# EAGLE design LPF (EAGLE 6.1)
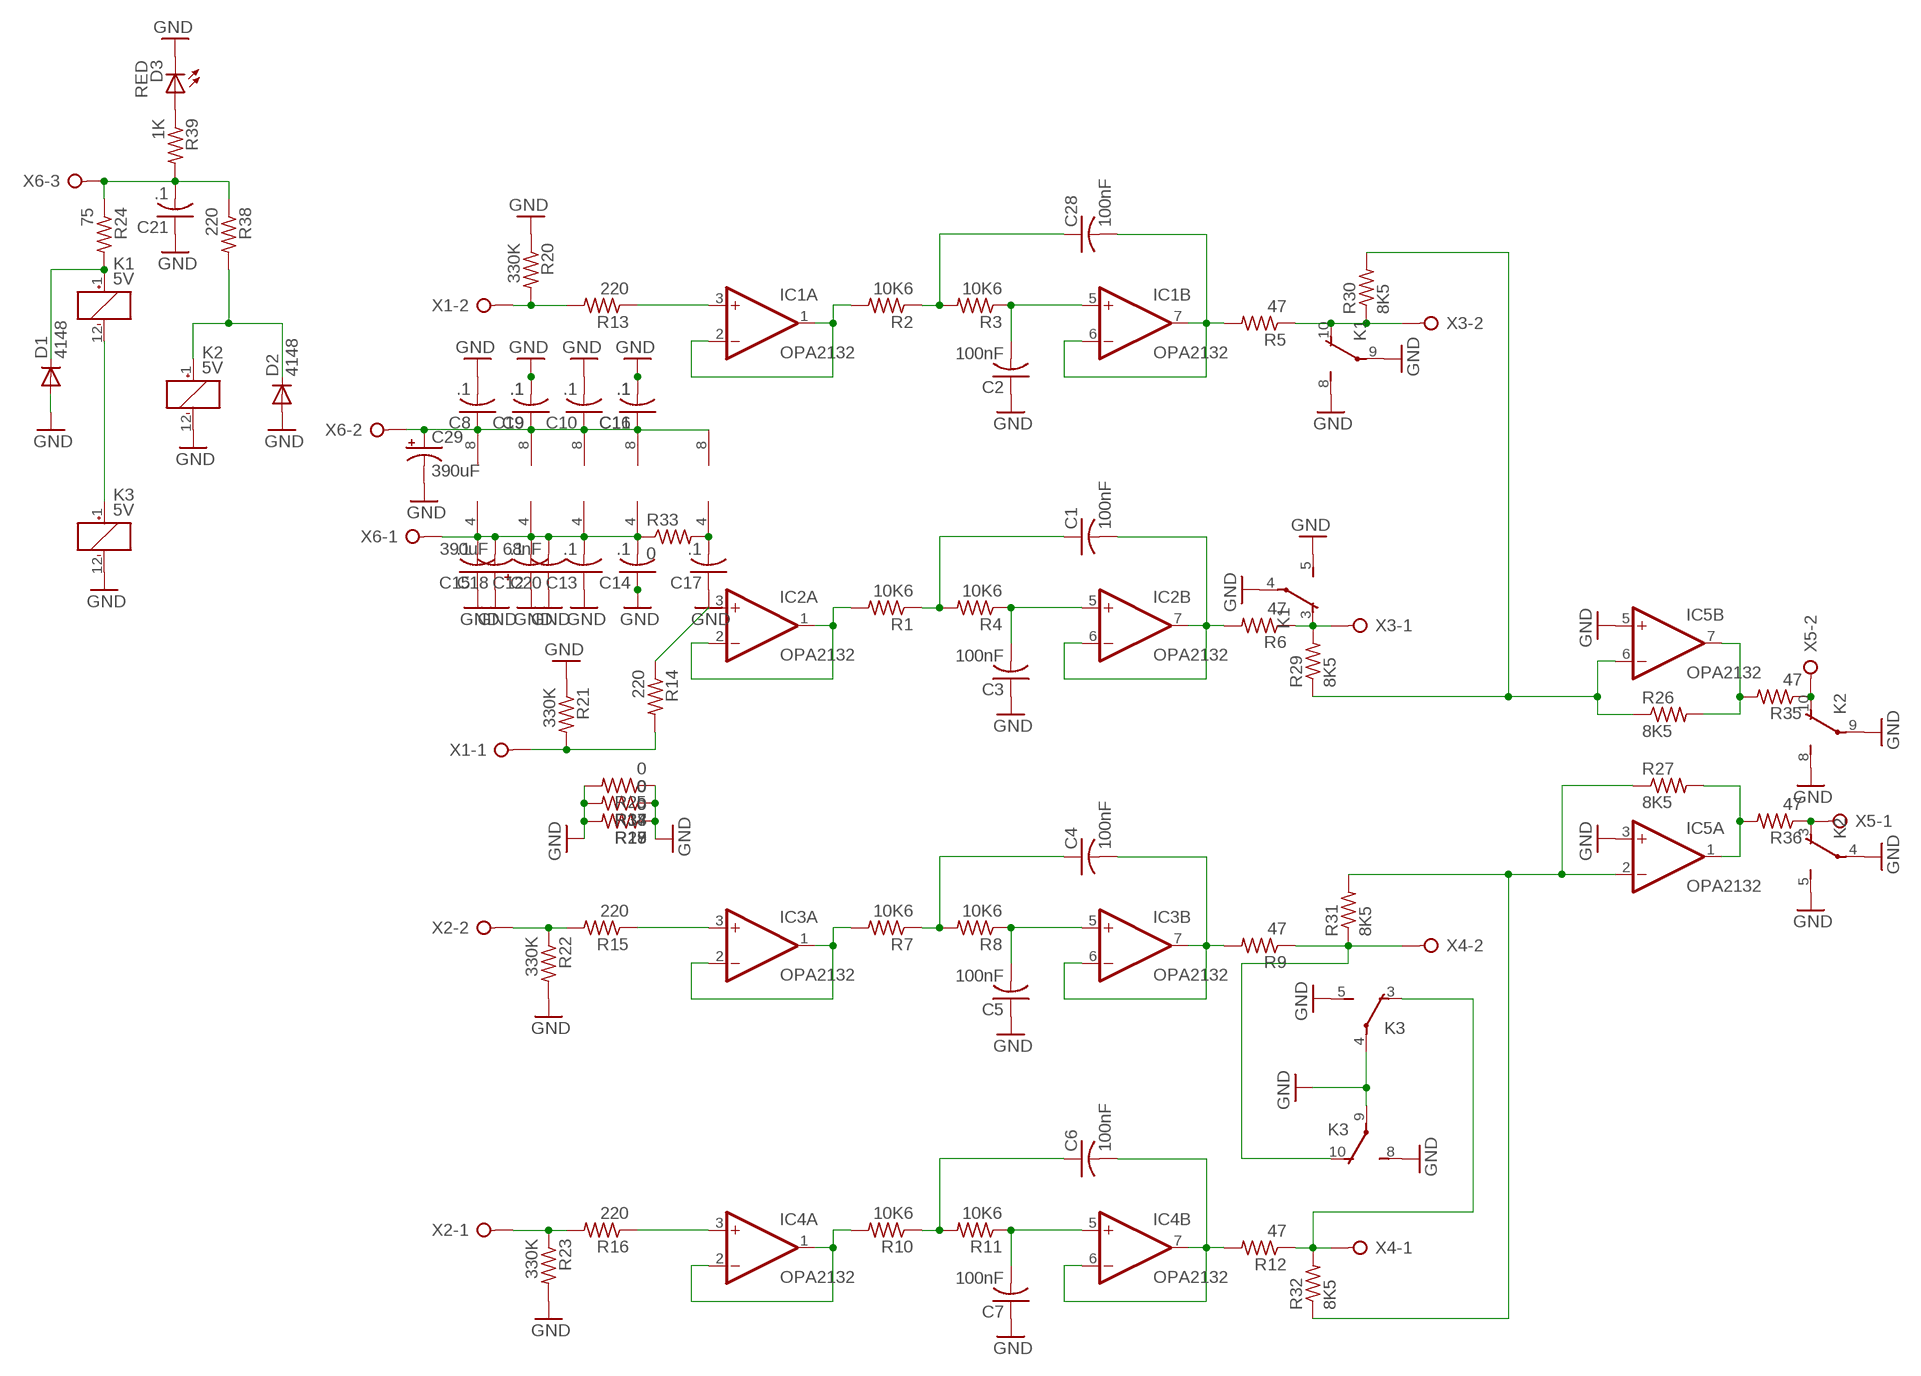
[diagram p0: schematic, sheet 1]

## Parts
C1  100nF  C-US050-075X075  [C050-075X075]
C2  100nF  C-US050-075X075  [C050-075X075]
C3  100nF  C-US050-075X075  [C050-075X075]
C4  100nF  C-US050-075X075  [C050-075X075]
C5  100nF  C-US050-075X075  [C050-075X075]
C6  100nF  C-US050-075X075  [C050-075X075]
C7  100nF  C-US050-075X075  [C050-075X075]
C8  .1  C-USC4532  [C4532]
C9  .1  C-USC4532  [C4532]
C10  .1  C-USC4532  [C4532]
C11  .1  C-USC4532  [C4532]
C12  .1  C-USC4532  [C4532]
C13  .1  C-USC4532  [C4532]
C14  .1  C-USC4532  [C4532]
C15  .1  C-USC4532  [C4532]
C16  .1  C-USC4532  [C4532]
C17  .1  C-USC4532  [C4532]
C18  390uF  CPOL-USE5-13  [E5-13]
C19  .1  C-USC4532  [C4532]
C20  68nF  C-US075-042X103  [C075-042X103]
C21  .1  C-USC4532  [C4532]
C28  100nF  C-US050-075X075  [C050-075X075]
C29  390uF  CPOL-USE5-13  [E5-13]
D1  4148  1N4148DO35-7  [DO35-7]
D2  4148  1N4148DO35-7  [DO35-7]
D3  RED  SFH482  [SFH482]
IC1  OPA2132  LM1458N  [DIL08]
IC2  OPA2132  LM1458N  [DIL08]
IC3  OPA2132  LM1458N  [DIL08]
IC4  OPA2132  LM1458N  [DIL08]
IC5  OPA2132  LM1458N  [DIL08]
K1  5V  TX2-12V  [TX2]
K2  5V  TX2-12V  [TX2]
K3  5V  TX2-12V  [TX2]
R1  10K6  R-US_0207/10  [0207/10]
R2  10K6  R-US_0207/10  [0207/10]
R3  10K6  R-US_0207/10  [0207/10]
R4  10K6  R-US_0207/10  [0207/10]
R5  47  R-US_0207/12  [0207/12]
R6  47  R-US_0207/12  [0207/12]
R7  10K6  R-US_0207/10  [0207/10]
R8  10K6  R-US_0207/10  [0207/10]
R9  47  R-US_0207/12  [0207/12]
R10  10K6  R-US_0207/10  [0207/10]
R11  10K6  R-US_0207/10  [0207/10]
R12  47  R-US_0207/10  [0207/10]
R13  220  R-US_0207/10  [0207/10]
R14  220  R-US_0207/10  [0207/10]
R15  220  R-US_0207/10  [0207/10]
R16  220  R-US_0207/10  [0207/10]
R17  0  R-US_0204/7  [0204/7]
R18  0  R-US_0204/7  [0204/7]
R19  0  R-US_0204/7  [0204/7]
R20  330K  R-US_R1210  [R1210]
R21  330K  R-US_R1210  [R1210]
R22  330K  R-US_R1210  [R1210]
R23  330K  R-US_R1210  [R1210]
R24  75  R-US_0207/10  [0207/10]
R25  0  R-US_0204/7  [0204/7]
R26  8K5  R-US_R1210  [R1210]
R27  8K5  R-US_R1210  [R1210]
R28  0  R-US_0204/7  [0204/7]
R29  8K5  R-US_R1210  [R1210]
R30  8K5  R-US_R1210  [R1210]
R31  8K5  R-US_R1210  [R1210]
R32  8K5  R-US_R1210  [R1210]
R33  0  R-US_0207/12  [0207/12]
R34  0  R-US_0204/7  [0204/7]
R35  47  R-US_0207/10  [0207/10]
R36  47  R-US_0207/10  [0207/10]
R37  0  R-US_0207/10  [0207/10]
R38  220  R-US_0309/12  [0309/12]
R39  1K  R-US_0207/10  [0207/10]
X1  W237-02P  [W237-132]
X2  W237-02P  [W237-132]
X3  W237-02P  [W237-132]
X4  W237-02P  [W237-132]
X5  W237-02P  [W237-132]
X6  W237-3E  [W237-3E]

## Nets
GND: C2.1 C3.1 C5.1 C7.1 C8.2 C9.2 C10.2 C11.2 C12.1 C13.1 C14.1 C15.1 C16.2 C17.1 C18.+ C19.2 C20.1 C21.1 C29.- D1.A D2.A D3.K(C) IC5.3(A:+IN) IC5.5(B:+IN) K1.4(1:P) K1.5(1:S) K1.8(2:S) K1.9(2:P) K2.4(1:P) K2.5(1:S) K2.8(2:S) K2.9(2:P) K2.12(_:-) K3.4(1:P) K3.5(1:S) K3.8(2:S) K3.9(2:P) K3.12(_:-) R17.1 R17.2 R18.1 R18.2 R19.1 R19.2 R20.1 R21.1 R22.2 R23.2 R25.1 R25.2 R28.1 R28.2 R34.1 R34.2 R37.1 R37.2
N$1: IC1.1(A:OUT) IC1.2(A:-IN) R2.2
N$2: C28.2 IC1.6(B:-IN) IC1.7(B:OUT) R5.2
N$3: C2.2 IC1.5(B:+IN) R3.1
N$4: C28.1 R2.1 R3.2
N$5: IC1.3(A:+IN) R13.1
N$6: R14.2 R21.2 X1.1
N$7: R13.2 R20.2 X1.2
N$8: IC2.1(A:OUT) IC2.2(A:-IN) R1.2
N$9: IC2.3(A:+IN) R14.1
N$10: C1.2 IC2.6(B:-IN) IC2.7(B:OUT) R6.2
N$11: C3.2 IC2.5(B:+IN) R4.1
N$12: C1.1 R1.1 R4.2
N$13: C12.2 C13.2 C14.2 C15.2 C18.- C20.2 IC1.4(P:V-) IC2.4(P:V-) IC3.4(P:V-) IC4.4(P:V-) R33.1 X6.1
N$14: C8.1 C9.1 C10.1 C11.1 C16.1 C19.1 C29.+ IC1.8(P:V+) IC2.8(P:V+) IC3.8(P:V+) IC4.8(P:V+) IC5.8(P:V+) X6.2
N$15: IC3.1(A:OUT) IC3.2(A:-IN) R7.2
N$16: IC3.3(A:+IN) R15.1
N$17: C4.2 IC3.6(B:-IN) IC3.7(B:OUT) R9.2
N$18: C5.2 IC3.5(B:+IN) R8.1
N$19: C4.1 R7.1 R8.2
N$20: R15.2 R22.1 X2.2
N$21: R16.2 R23.1 X2.1
N$22: IC4.1(A:OUT) IC4.2(A:-IN) R10.2
N$23: IC4.3(A:+IN) R16.1
N$24: C6.2 IC4.6(B:-IN) IC4.7(B:OUT) R12.2
N$25: C7.2 IC4.5(B:+IN) R11.1
N$26: C6.1 R10.1 R11.2
N$27: K3.3(1:O) R12.1 R32.2 X4.1
N$28: K3.10(2:O) R9.1 R31.1 X4.2
N$29: K1.12(_:-) K3.1(_:+)
N$30: K1.10(2:O) R5.1 R30.1 X3.2
N$31: K1.3(1:O) R6.1 R29.2 X3.1
N$32: C17.2 IC5.4(P:V-) R33.2
N$33: D1.C K1.1(_:+) R24.2
N$34: IC5.6(B:-IN) R26.1 R29.1 R30.2
N$35: IC5.7(B:OUT) R26.2 R35.2
N$36: IC5.1(A:OUT) R27.2 R36.2
N$37: K2.10(2:O) R35.1 X5.2
N$38: IC5.2(A:-IN) R27.1 R31.2 R32.1
N$39: K2.3(1:O) R36.1 X5.1
N$40: D2.C K2.1(_:+) R38.2
N$41: C21.2 R24.1 R38.1 R39.2 X6.3
N$42: D3.A R39.1

## Library data of the parts
C1-C17 C19-C21 C28 = resistor:C-US: CAPACITOR, American symbol
C18 C29 = resistor:CPOL-US: POLARIZED CAPACITOR, American symbol
D1 D2 = diode:1N4148: DIODE high speed (Philips)
D3 = led:SFH482: IR LED infrared emitting diode, Infineon
IC1-IC5 = linear:*1458: OP AMP
K1-K3 = relay:TX2?-*: 2 AMP. HIGH CAPACITY RELAY NAiS WITH HIGH SURGE VOLTAGE & HIGH BREAKDOWN VOLTAGE Source: http://www.mew-europe.com/.. en_ds_61022_0001.pdf; MF: AROMAT/ MATSUSHITA; MPN: TX2-12V; OC_FARNELL: 1200952; OC_NEWARK: 67K1295
R1-R39 = resistor:R-US_: RESISTOR, American symbol
X1-X5 = con-wago-508:W237-02P: WAGO SREW CLAMP; OC_FARNELL: unknown; OC_NEWARK: unknown
X6 = con-wago-508:W237-3E: WAGO SREW CLAMP; OC_FARNELL: unknown; OC_NEWARK: unknown

## Board
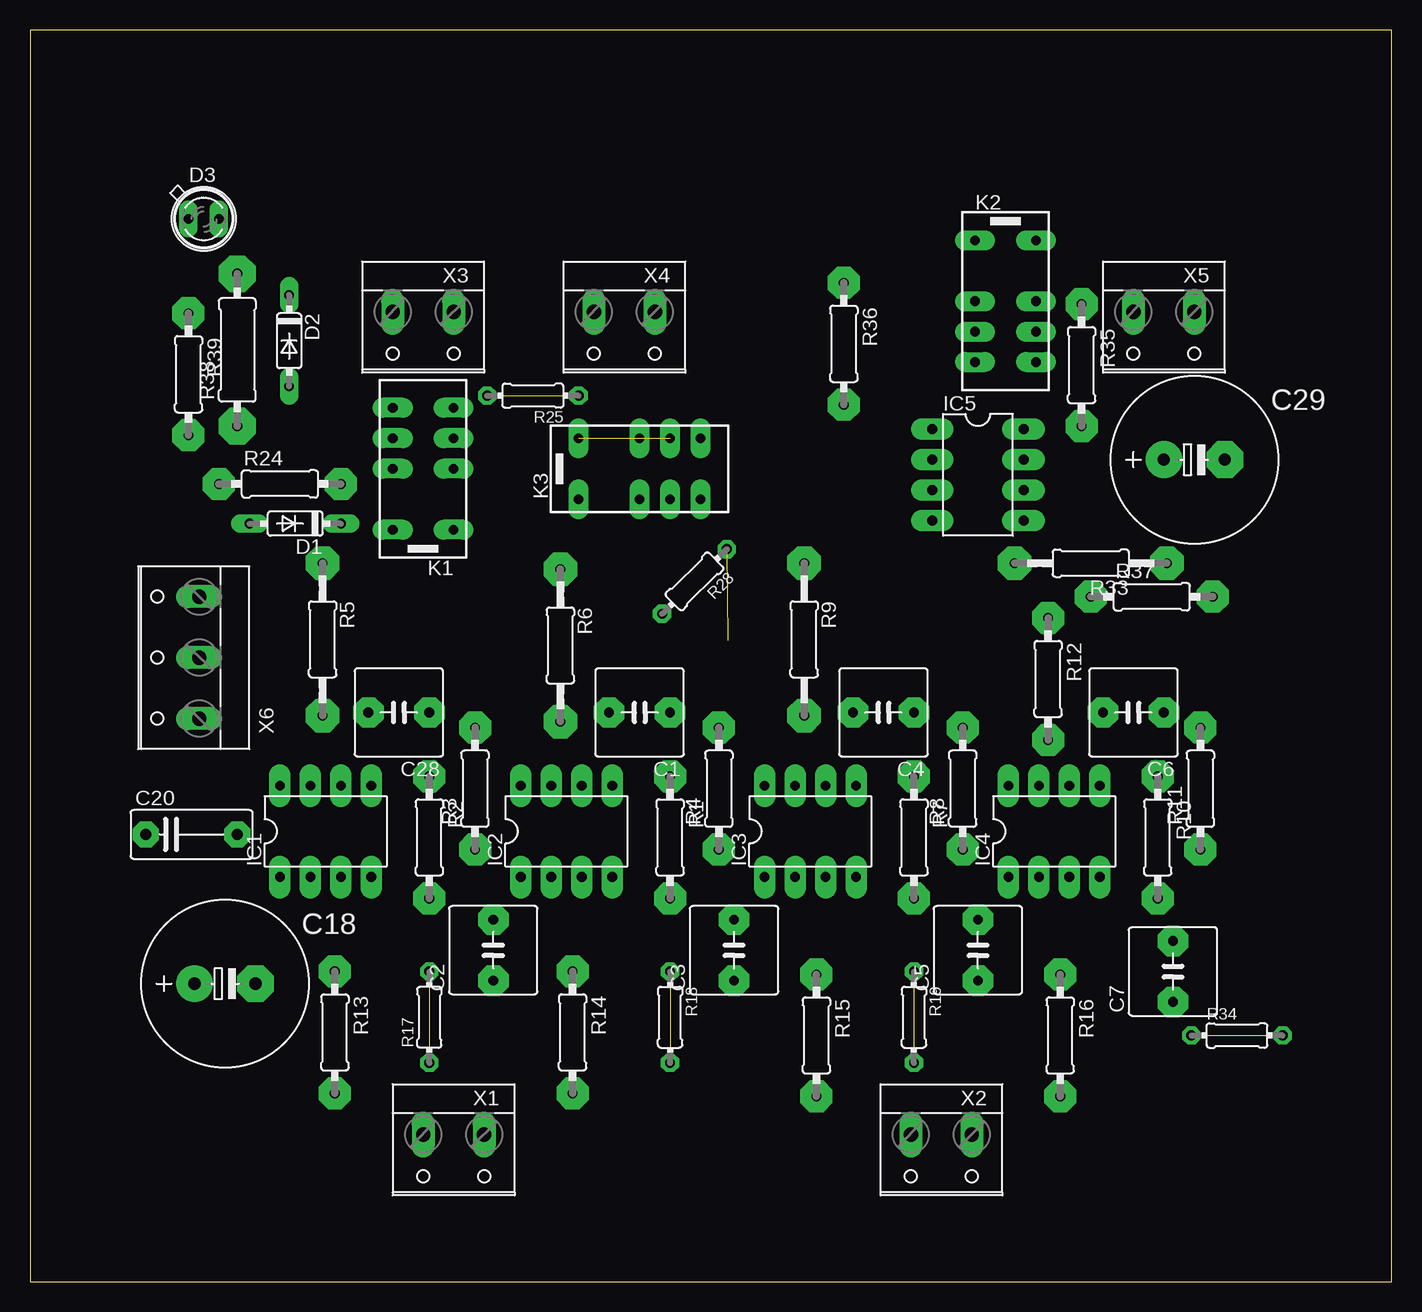
[diagram p1: board, top side]
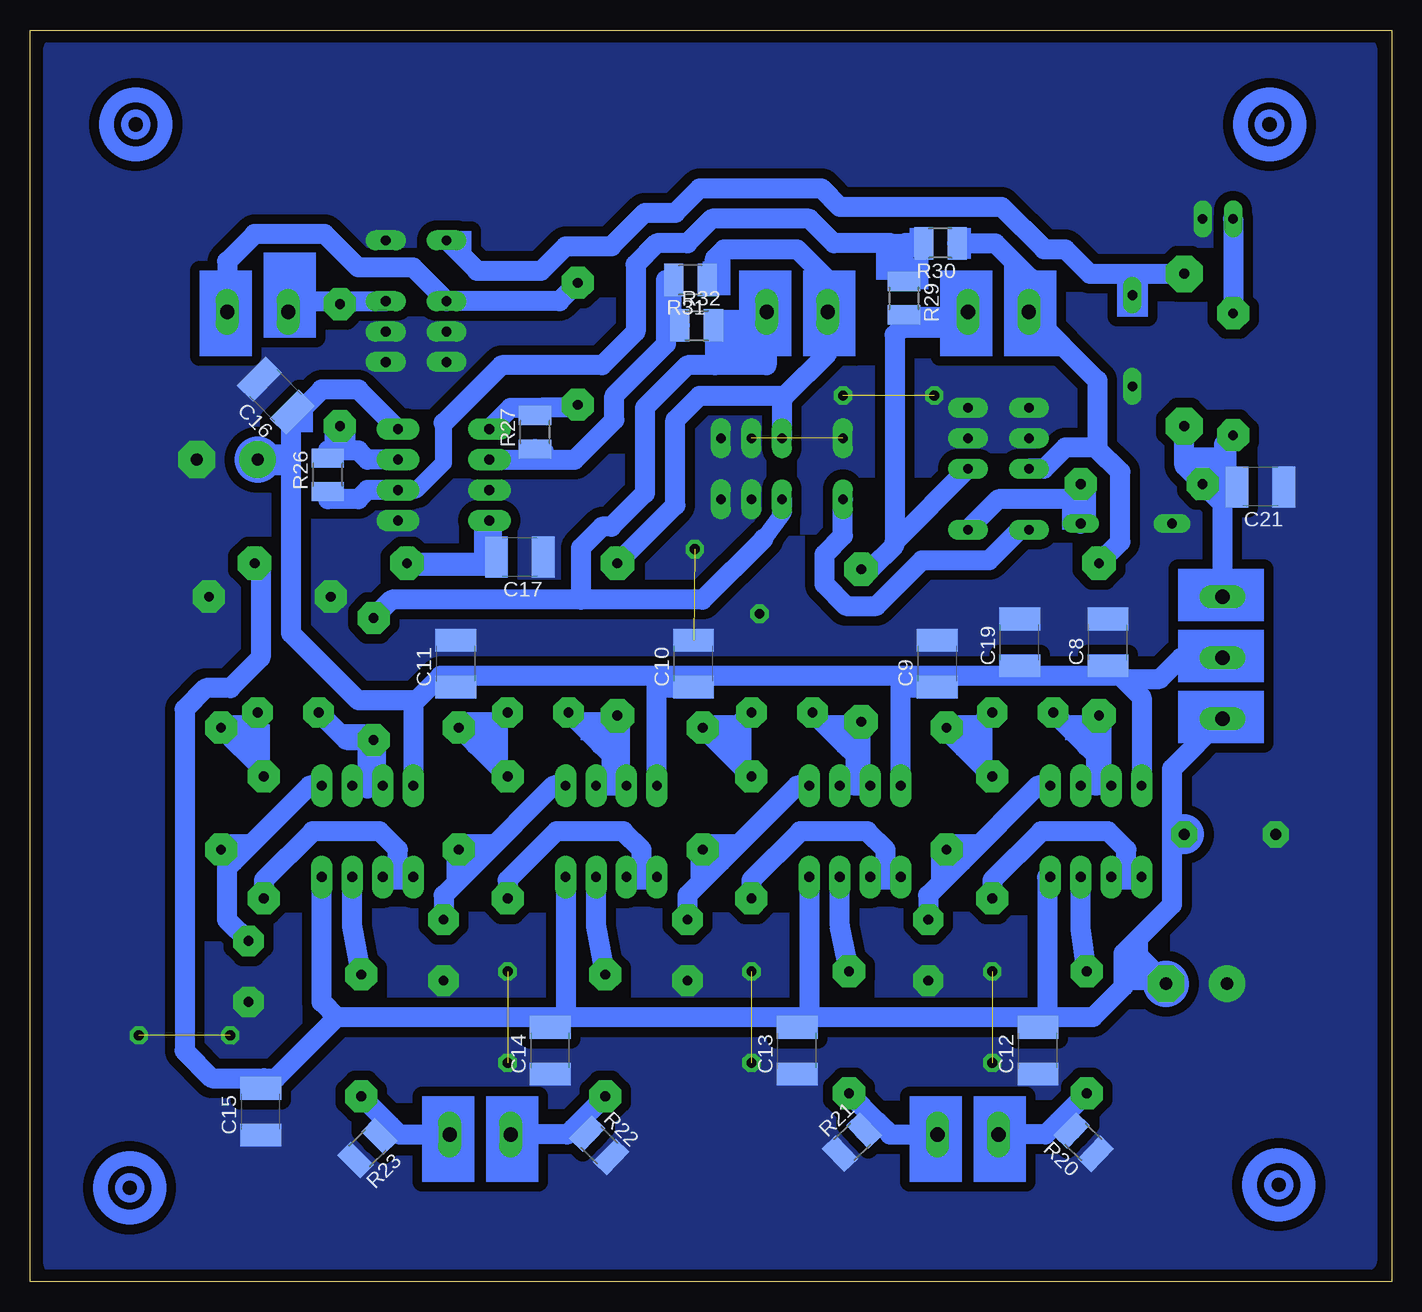
[diagram p2: board, bottom side, seen from below]

Size 113.46 x 104.37 mm. Coordinates in mm from the lower left corner, seen from the top.
Outline: 0,104.37 0,0 113.46,0 113.46,104.37 0,104.37
Copper layers (1*16): Top 0.035mm / dielectric 1.5mm / Bottom 0.035mm
Design rules: minimum track width 10mil, minimum drill 24mil, track to track 8mil, track to pad 8mil, pad to pad 8mil, via to via 8mil, smd to smd 8mil, copper to edge 40mil, drill to drill 8mil, minimum pad ring 14mil, minimum via ring 8mil, stop-mask expansion 4mil, vias tented up to drill 0mil, thermal gap 10mil

### Footprints (pad centres in the part's own frame; a part is rotated, then mirrored left to right if it is on the bottom)
C050-075X075 = drill 0.813 pad 2.54 octagon: 1 -2.54,0; 2 2.54,0
C4532 = smd 1.9 x 3.4: 1 -1.95,0; 2 1.95,0
E5-13 = drill 1.016 pad 3.048: + -2.54,0 | drill 1.016 pad 3.048 octagon: - 2.54,0
C075-042X103 = drill 0.914 pad 2.184 octagon: 1 -3.81,0; 2 3.81,0
DO35-7 = drill 0.813 long: A 3.81,0; C -3.81,0
SFH482 = drill 0.813 long: A -1.27,0; K 1.27,0
DIL08 = drill 0.813 pad 1.778 long: 1 -3.81,-3.81; 2 -1.27,-3.81; 3 1.27,-3.81; 4 3.81,-3.81; 5 3.81,3.81; 6 1.27,3.81; 7 -1.27,3.81; 8 -3.81,3.81
TX2 = drill 0.8 pad 1.676 long: 1 -5.08,-2.54; 3 0,-2.54; 4 2.54,-2.54; 5 5.08,-2.54; 8 5.08,2.54; 9 2.54,2.54; 10 0,2.54; 12 -5.08,2.54
0207/10 = drill 0.813 pad 2.667 octagon: 1 -5.08,0; 2 5.08,0
0207/12 = drill 0.813 pad 2.794 octagon: 1 -6.35,0; 2 6.35,0
0204/7 = drill 0.813 octagon: 1 -3.81,0; 2 3.81,0
R1210 = smd 1.6 x 2.7: 1 -1.4,0; 2 1.4,0
0309/12 = drill 0.813 pad 3.048 octagon: 1 -6.35,0; 2 6.35,0
W237-132 = drill 1.194 long: 1 -2.54,-0.635; 2 2.54,-0.635
W237-3E = drill 1.194 long: 1 -5.08,-0.635; 2 0,-0.635; 3 5.08,-0.635

### Placement (x,y rotation side)
C1  50.8,47.48 180 top
C2  38.61,27.67 90 top
C3  58.67,27.67 90 top
C4  71.12,47.48 180 top
C5  78.99,27.67 90 top
C6  91.95,47.48 180 top
C7  95.25,25.89 90 top
C8  23.62,53.32 90 bottom
C9  37.85,51.54 90 bottom
C10  58.17,51.54 90 bottom
C11  77.98,51.54 90 bottom
C12  29.46,19.28 90 bottom
C13  49.53,19.28 90 bottom
C14  70.1,19.28 90 bottom
C15  94.23,14.2 90 bottom
C16  92.96,73.89 134.9 bottom
C17  72.64,60.43 180 bottom
C18  16.26,24.87 0 top
C19  30.99,53.32 90 bottom
C20  13.46,37.32 0 top
C21  10.92,66.27 180 bottom
C28  30.73,47.48 180 top
C29  97.03,68.56 0 top
D1  22.1,63.23 180 top
D2  21.59,78.47 270 top
D3  14.48,88.63 0 top
IC1  24.64,37.57 0 top
IC2  44.7,37.57 0 top
IC3  65.02,37.57 0 top
IC4  85.34,37.57 0 top
IC5  78.99,67.29 270 top
K1  32.77,67.8 90 top
K2  81.28,81.77 270 top
K3  50.8,67.8 0 top
R1  53.34,37.06 270 top
R2  33.27,37.06 270 top
R3  37.08,41.13 90 top
R4  57.4,41.13 90 top
R5  24.38,53.57 270 top
R6  44.2,53.07 270 top
R7  73.66,37.06 270 top
R8  77.72,41.13 90 top
R9  64.52,53.57 270 top
R10  93.98,37.06 270 top
R11  97.54,41.13 90 top
R12  84.84,50.27 270 top
R13  25.4,20.81 270 top
R14  45.21,20.81 270 top
R15  65.53,20.55 270 top
R16  85.85,20.55 270 top
R17  33.27,22.08 90 top
R18  53.34,22.08 270 top
R19  73.66,22.08 270 top
R20  25.65,11.66 135.8 bottom
R21  44.96,11.66 43.9 bottom
R22  66.04,11.41 315.6 bottom
R23  85.34,11.16 225 bottom
R24  20.83,66.53 0 top
R25  41.91,73.89 180 top
R26  88.65,67.29 90 bottom
R27  71.37,70.85 90 bottom
R28  55.37,58.4 225 top
R29  40.64,82.02 270 bottom
R30  37.59,86.59 180 bottom
R31  58.42,83.55 180 bottom
R32  57.91,79.74 0 bottom
R33  88.39,59.92 180 top
R34  100.58,20.55 0 top
R35  87.63,76.43 270 top
R36  67.82,78.21 270 top
R37  93.47,57.13 0 top
R38  17.27,77.7 90 top
R39  13.21,75.67 270 top
X1  35.31,11.66 180 top
X2  75.95,11.66 180 top
X3  32.77,80.24 180 top
X4  49.53,80.24 180 top
X5  94.49,80.24 180 top
X6  13.46,52.05 90 top

### Tracks (layer width: path | path; a pad name or v marks a point on that pad's centre or on a via)
GND  (7 unrouted)
  pour Bottom (isolate 0.813, no thermals): 111.51,102.85 2.03,102.85 2.03,1.76 111.51,1.5
N$1
  Bottom 1.676: IC1.1 22.1,33.76 | IC1.2 22.1,33.76 | 22.1,33.76 22.1,36.05 23.62,37.57 29.21,37.57 33.27,33.51 R2.2
N$2
  Bottom 1.676: IC1.7 24.64,41.38 | 24.64,41.38 IC1.6 | C28.2 25.4,44.68 | 25.4,44.68 24.64,43.92 24.64,41.38 | R5.2 25.4,44.94 25.4,44.68
N$3
  Bottom 1.676: IC1.5 29.46,41.38 35.81,35.03 | 35.81,35.03 38.61,32.24 C2.2 | R3.1 35.81,35.03
N$4
  Bottom 1.676: R2.1 35.69,44.56 | 35.69,44.56 37.08,45.95 R3.2 | C28.1 35.69,45.06 35.69,44.56
N$5
  Bottom 1.676: R13.1 25.91,29.44 IC1.3
N$6
  Bottom 1.676: R14.2 42.8,13.32 | 42.8,13.32 41.78,12.3 X1.1 | R21.2 43.27,13.32 42.8,13.32
N$7
  Bottom 1.676: R13.2 27.81,13.32 | 27.81,13.32 28.83,12.3 X1.2 | R20.2 27.33,13.32 27.81,13.32
N$8
  Bottom 1.676: IC2.1 42.16,33.76 | IC2.2 42.16,33.76 | 42.16,33.76 42.16,36.05 43.69,37.57 49.28,37.57 53.34,33.51 R1.2
N$9
  Bottom 1.676: R14.1 45.97,29.7 IC2.3
N$10
  Bottom 1.676: C1.2 45.59,44.81 | 45.59,44.81 44.7,43.92 44.7,41.38 | 44.7,41.38 IC2.6 | 44.7,41.38 IC2.7 | R6.2 45.59,44.81
N$11
  Bottom 1.676: IC2.5 49.53,41.38 55.88,35.03 | 55.88,35.03 58.67,32.24 C3.2 | R4.1 55.88,35.03
N$12
  Bottom 1.676: R1.1 56.26,45.06 | 56.26,45.06 R4.2 | C1.1 55.75,45.06 56.26,45.06
N$13
  Bottom 1.676: IC2.4 48.51,22.08 | IC1.4 28.7,33.76 28.7,22.08 | 28.7,22.08 28.96,22.08 | 28.96,22.08 48.51,22.08 | 48.51,22.08 49.53,22.08 | 49.53,22.08 68.83,22.08 | 68.83,22.08 69.6,22.08 | 69.6,22.08 87.88,22.08 | IC3.4 68.83,22.08 | C14.2 69.6,21.74 69.6,22.08 | C13.2 49.53,22.08 | C12.2 28.96,21.74 28.96,22.08 | 93.98,17 98.3,17 100.58,19.28 100.58,47.73 98.81,49.51 96.77,49.51 94.23,52.05 94.23,59.42 R33.1 | 93.98,17 92.96,17 87.88,22.08 | C15.2 93.98,16.41 93.98,17 | 87.88,22.08 89.15,23.35 IC4.4 | X6.1 18.29,42.78 18.29,37.06 | 28.7,22.08 24.89,22.08 22.35,24.62 22.35,27.41 | 18.29,37.06 18.29,31.48 22.35,27.41 | C18.- 21.34,27.41 22.35,27.41 | C20.2 17.53,37.06 18.29,37.06
N$14
  Bottom 1.676: IC2.8 40.89,50.53 | 40.89,50.53 61.21,50.53 | 61.21,50.53 79.25,50.53 | 22.61,50.53 31.24,50.53 | 31.24,50.53 40.89,50.53 | 81.53,48.49 IC4.8 | IC3.8 61.21,50.53 | C9.1 40.89,50.53 | 61.21,50.53 C10.1 | C11.1 79.25,50.53 | 81.53,48.49 86.11,48.49 91.69,54.08 91.69,68.56 | IC5.8 86.11,74.4 89.15,74.4 91.19,72.37 | 79.25,50.53 81.28,48.49 81.53,48.49 | 91.19,72.37 91.69,71.86 91.69,68.56 | 22.61,50.53 22.35,50.27 | IC1.8 20.83,48.75 22.35,50.27 | 22.61,50.53 23.45,51.37 C8.1 | 22.35,50.27 19.3,50.27 17.53,52.05 X6.2 | C29.+ 91.69,68.56 | C16.1 91.44,72.37 91.19,72.37 | C19.1 31.24,51.12 31.24,50.53
N$15
  Bottom 1.676: IC3.1 62.48,33.76 | IC3.2 62.48,33.76 | 62.48,33.76 62.48,36.05 64.01,37.57 69.6,37.57 73.66,33.51 R7.2
N$16
  Bottom 1.676: R15.1 66.29,29.7 IC3.3
N$17
  Bottom 1.676: C4.2 65.91,44.81 | 65.91,44.81 65.02,43.92 65.02,41.38 | 65.02,41.38 IC3.7 | IC3.6 65.02,41.38 | R9.2 65.91,44.81
N$18
  Bottom 1.676: IC3.5 69.85,41.38 76.2,35.03 | 76.2,35.03 78.99,32.24 C5.2 | R8.1 76.2,35.03
N$19
  Bottom 1.676: R7.1 76.33,44.81 | 76.33,44.81 R8.2 | C4.1 76.33,44.81
N$20
  Bottom 1.676: R15.2 68.2,12.81 | 68.2,12.81 68.71,12.3 X2.2 | R22.1 67.46,12.81 68.2,12.81
N$21
  Bottom 1.676: R16.2 83.44,13.06 | 83.44,13.06 82.68,12.3 X2.1 | R23.1 83.44,13.06
N$22
  Bottom 1.676: IC4.1 82.8,33.76 | IC4.2 82.8,33.76 | 82.8,33.76 82.8,36.05 84.33,37.57 89.92,37.57 93.98,33.51 R10.2
N$23
  Bottom 1.676: R16.1 86.61,29.7 IC4.3
N$24
  Bottom 1.676: 85.34,41.38 85.34,44.68 85.72,45.06 85.72,45.32 R12.2 87.12,45.19 C6.2 | 85.34,41.13 85.34,41.38 | 85.34,41.38 IC4.7 | IC4.6 85.34,41.38
N$25
  Bottom 1.676: IC4.5 90.17,41.38 96.52,35.03 | R11.1 96.52,35.03 | C7.2 97.03,30.21 97.03,34.52 96.52,35.03
N$26
  Bottom 1.676: R11.2 95.88,44.56 | 95.88,44.56 93.98,42.65 R10.1 | C6.1 95.88,44.81 95.88,44.56
N$27
  Bottom 1.422: 50.8,64.24 50.8,63.99 52.32,61.96
  Bottom 1.676: 67.56,56.88 57.4,56.88 52.32,61.96 | 67.56,56.88 83.31,56.88 R12.1 | X4.1 52.07,76.43 56.39,76.43 | 56.39,76.43 58.67,76.43 62.23,72.88 62.23,65.77 65.02,62.97 65.79,62.97 67.56,61.19 67.56,56.88 | K3.3 50.8,64.24 | R32.2 56.39,79.61 56.39,76.43
N$28
  Bottom 1.676: R9.1 59.69,64.75 59.69,71.86 57.66,73.89 50.8,73.89 | 50.8,73.89 K3.10 | 50.8,73.89 50.55,73.89 46.99,77.45 X4.2 46.99,83.55 49.53,86.09 55.63,86.09 56.39,85.32 56.39,83.67 R31.1
N$29
  Bottom 1.676: K3.1 45.72,62.21 47.24,60.69 47.24,58.15 45.47,56.37 42.93,56.37 39.12,60.18 33.53,60.18 30.99,62.72 K1.12
N$30
  Bottom 1.676: R5.1 22.61,61.7 22.61,67.54 24.51,69.45 | 24.51,69.45 24.64,69.58 27.18,69.58 28.96,67.8 K1.10 | 24.51,69.45 24.51,75.16 X3.2 30.23,83.8 33.02,86.59 R30.1
N$31
  Bottom 1.676: R29.2 40.64,79.99 | 40.64,79.99 40.64,79.48 | X3.1 36.2,79.99 40.39,79.99 | 40.39,79.99 40.64,79.99 | 40.39,79.99 41.4,78.97 41.4,61.7 | K1.3 41.4,61.7 | 41.4,61.7 41.4,61.45 43.43,59.42 R6.1
N$32
  Bottom 1.676: IC5.4 75.18,60.43 | 75.18,60.43 75.18,59.92 R33.2 | C17.2 75.18,60.43
N$33
  Bottom 1.676: R24.2 25.91,65.26 | D1.C 25.91,65.26 | 25.91,65.26 32.77,65.26 K1.1
N$34
  Bottom 1.422: IC5.6 81.28,66.02 78.99,68.31 78.99,71.61
  Bottom 1.676: R30.2 40.64,86.59 40.64,85.58 | R29.1 40.64,85.58 | 40.64,85.58 41.66,86.59 46.48,86.59 48.51,88.63 56.64,88.63 58.67,86.59 61.21,86.59 62.99,84.82 62.99,79.23 65.79,76.43 74.17,76.43 78.99,71.61 | IC5.6 85.34,66.02 86.11,65.26 88.65,65.26 R26.1
N$35
  Bottom 1.676: IC5.7 85.34,68.56 86.11,69.32 87.63,69.32 | 87.63,69.32 88.65,69.32 R26.2 | R35.2 87.63,69.32
N$36
  Bottom 1.676: 70.87,72.88 R27.2 | R36.2 68.07,72.88 70.87,72.88 | IC5.1 73.41,72.88 70.87,72.88
N$37
  Bottom 1.676: X5.2 91.06,81.77 87.63,81.77 | 87.63,81.77 K2.10 | R35.1 87.63,81.77
N$38
  Bottom 1.676: R32.1 60.45,80.88 | 60.45,80.88 60.45,83.55 R31.2 | IC5.2 70.61,68.56 | 70.61,68.56 68.07,68.56 64.77,71.86 64.77,73.89 60.45,78.21 60.45,80.88 | R27.1 70.61,69.19 70.61,68.56
N$39
  Bottom 1.676: R36.1 69.34,81.77 K2.3 81.53,84.56 86.11,84.56 88.9,87.36 94.74,87.36 97.03,85.07 X5.1
N$40
  Bottom 1.676: K2.1 76.2,84.31 70.87,84.31 68.83,86.34 65.02,86.34 62.23,89.13 59.69,89.13 57.66,91.17 47.5,91.17 45.97,89.64 32.51,89.64 28.96,86.09 27.18,86.09 25.15,84.05 21.59,84.05 | 21.59,84.05 R38.2 | D2.C 21.59,84.05
N$41
  Bottom 1.676: R38.1 17.27,68.05 R24.1 15.11,65.89 | 15.11,65.89 14.1,64.88 X6.3 | C21.2 13.25,65.89 13.97,65.89 | 13.97,65.89 15.11,65.89 | R39.2 13.97,69.83 13.97,65.89
N$42
  Bottom 1.676: D3.A R39.1
(copper drawn outside any net)
  shapes: Bottom area x85, Bottom circle x12